# EasyEDA Pro project ProProject_四轴飞行器_2024-06-06.epro

# Schematic Schematic1
Create Date: 2024-06-06; Page Name: P1; Project Name: 四轴飞行器; Schematic Name: Schematic1; Update Date: 2024-06-06; Company: 嘉立创EDA; Page Size: A4; Version: V1.0
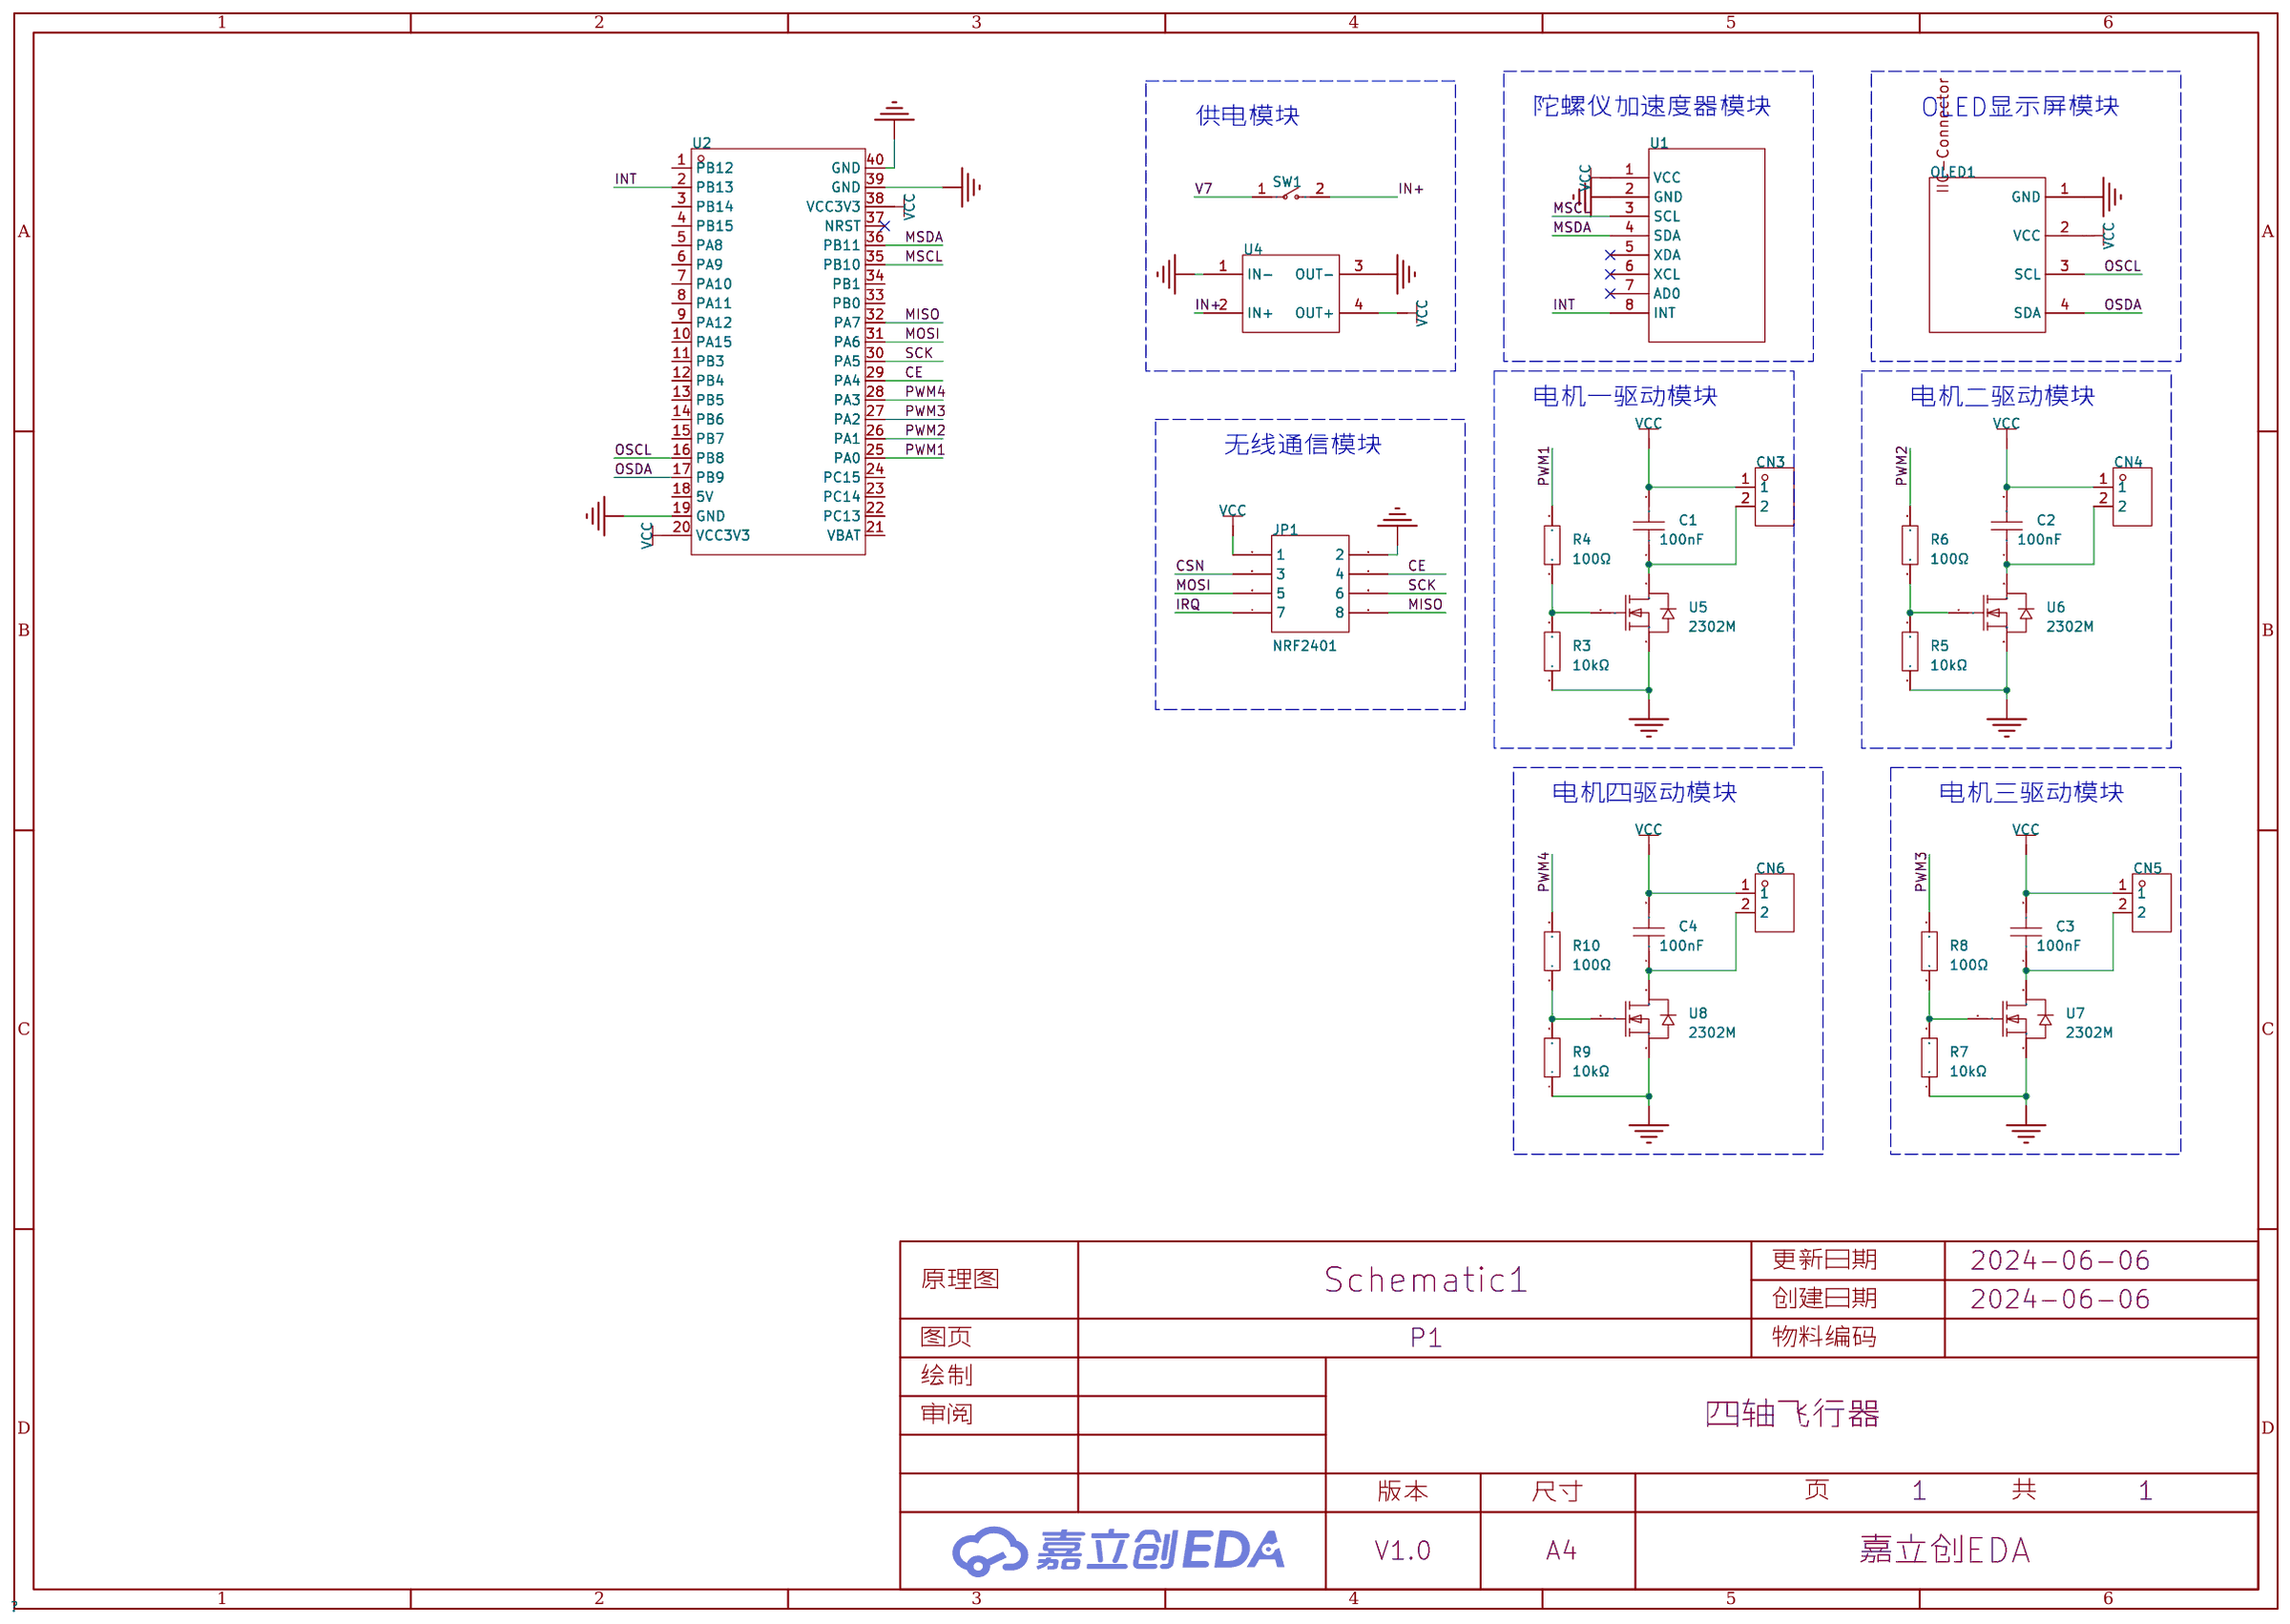
[diagram p0: schematic sheet]

## Parts
C1  100nF  [C0603]
C2  100nF  [C0603]
C3  100nF  [C0603]
C4  100nF  [C0603]
CN3  ZX-XH2.54-2PZZ  [CONN-TH_2P-P2.50_HX25003-2A]
CN4  ZX-XH2.54-2PZZ  [CONN-TH_2P-P2.50_HX25003-2A]
CN5  ZX-XH2.54-2PZZ  [CONN-TH_2P-P2.50_HX25003-2A]
CN6  ZX-XH2.54-2PZZ  [CONN-TH_2P-P2.50_HX25003-2A]
JP1  NRF2401  [IDE2X4]
OLED1  0.96OLED_4P_MODULE_JX  [0.96OLED_4P]
R3  10kΩ  [R0805]
R4  100Ω  [R0805]
R5  10kΩ  [R0805]
R6  100Ω  [R0805]
R7  10kΩ  [R0805]
R8  100Ω  [R0805]
R9  10kΩ  [R0805]
R10  100Ω  [R0805]
SW1  KCD11-2P-R  [SW-TH_2P-L15.0-W10.5-P5.00_KCD11-2P-R]
U1  -  [Module-MPU6050]
U2  STM32F103C8T6-Card  [CONN-TH_L53.3-W22.9_STM32F103C8T6-CARD]
U4  -  [MP1548EN可调电源模块]
U5  2302M  [SOT-23-3_L2.9-W1.3-P0.95-LS2.4-BR]
U6  2302M  [SOT-23-3_L2.9-W1.3-P0.95-LS2.4-BR]
U7  2302M  [SOT-23-3_L2.9-W1.3-P0.95-LS2.4-BR]
U8  2302M  [SOT-23-3_L2.9-W1.3-P0.95-LS2.4-BR]

## Library data of the parts
C1-C4 = CC0603KRX7R9BB104: 容值:100nF;精度:±10%;额定电压:50V;材质(温度系数):X7R;; LCSC Part Name: 100nF ±10% 50V; Supplier Part: C14663; Manufacturer: YAGEO(国巨); Supplier Footprint: 0603; Datasheet: https://atta.szlcsc.com/upload/public/pdf/source/20180910/C282072_33301C7F631E79921B82A8DAC6BCC5B3.pdf; Supplier: LCSC; Tolerance: ±10%; Voltage Rated: 50V; Temperature Coefficient: X7R
CN3-CN6 = ZX-XH2.54-2PZZ: 插针结构:1x2P;间距:2.54mm;安装方式:直插;参考系列:XH;总PIN数:2P;排数:1;每排PIN数:2;行距:-;额定电流:3A;触头材质:黄铜;触头镀层:锡;工作温度范围:-25℃~+85℃;; Supplier Part: C7429632; Manufacturer: Megastar(兆星); Supplier Footprint: 插件,P=2.54mm; JLCPCB Part Class: 扩展库; Datasheet: https://atta.szlcsc.com/upload/public/pdf/source/20230619/19BA6947230AA44A04D3EDD65E618FD0.pdf; Supplier: LCSC; Pins Structure: 1x2P; Pitch: 2.54mm; Mounting Style: 直插; Reference Series: XH; Number of Pins: 2P; Number of Rows: 1; Number of PINs Per Row: 2; Current Rating (Max): 3A; Contact Material: 黄铜; Contact Plating: 锡; Operating Temperature Range: -25℃~+85℃
JP1 = NRF2401
OLED1 = 0.96OLED_4P_MODULE_JX: Supplier Part: C9900004566; Supplier Footprint: 插件; JLCPCB Part Class: 扩展库; Supplier: LCSC
R3 R5 R7 R9 = 0805W8F1002T5E_C17414: 电阻类型:厚膜电阻;阻值:10kΩ;精度:±1%;功率:125mW;最大工作电压:150V;温度系数:±100ppm/℃;; LCSC Part Name: 10kΩ ±1% 125mW 厚膜电阻; Supplier Part: C17414; Manufacturer: UNI-ROYAL(厚声); Manufacturer Part: 0805W8F1002T5E; Supplier Footprint: 0805; Datasheet: https://atta.szlcsc.com/upload/public/pdf/source/20200306/C422600_1E6D84923E4A46A82E41ADD87F860B5C.pdf; Supplier: LCSC; Type: 厚膜电阻; Tolerance: ±1%; Power(Watts): 125mW; Overload Voltage (Max): 150V; Temperature Coefficient: ±100ppm/℃; Operating Temperature Range: -55℃~+155℃
R4 R6 R8 R10 = 0805W8F1000T5E: 电阻类型:厚膜电阻;阻值:100Ω;精度:±1%;功率:125mW;最大工作电压:150V;温度系数:±100ppm/℃;; LCSC Part Name: 100Ω ±1% 125mW 厚膜电阻; Supplier Part: C17408; Manufacturer: UNI-ROYAL(厚声); Supplier Footprint: 0805; Datasheet: https://atta.szlcsc.com/upload/public/pdf/source/20200306/C422600_1E6D84923E4A46A82E41ADD87F860B5C.pdf; Supplier: LCSC; Type: 厚膜电阻; Tolerance: ±1%; Power(Watts): 125mW; Overload Voltage (Max): 150V; Temperature Coefficient: ±100ppm/℃; Operating Temperature Range: -55℃~+155℃
SW1 = KCD11-2P-R: 带灯:无;引脚样式:焊片;额定电流:3A;额定电压(AC):250V;额定电压(DC):-;电路结构:单刀单掷;机械寿命:1万次;; LCSC Part Name: 10.5*15mm 两脚两档跷板开关 红钮; Supplier Part: C5884414; Manufacturer: SHOU HAN(首韩); Supplier Footprint: 插件; JLCPCB Part Class: 扩展库; Datasheet: https://atta.szlcsc.com/upload/public/pdf/source/20230506/CD06DFDE35C8048D34175BFF4AF6A2C2.pdf; Supplier: LCSC; Switch Length: 15mm; Switch Width: 10.5mm; Switch Height: 17.2mm; Actuator Type: 凹面弯曲; With Lamp: 无; Pin Style: 焊片; Actuator Color: 红色; Contact Current: 3A; Voltage Rating (AC): 250V; Circuit: 单刀单掷; Mechanical Life: 1万次; Operating Temperature: 0℃~+125℃; Actuator Identifier: - O
U1 = MPU6050模块
U2 = STM32F103C8T6-Card: Supplier Part: C9900077949; Supplier Footprint: 插件; Supplier: LCSC
U4 = MP1584EN可调电源降压模块: 输入4.5-28V；输出0.8-20V，Max3A；尺寸22*17*4mm; Manufacturer: 淘宝zave旗舰店
U5-U8 = 2302M: Supplier Part: C19190096; Manufacturer: FM(富满); Supplier Footprint: SOT-23; JLCPCB Part Class: 扩展库; Datasheet: https://atta.szlcsc.com/upload/public/pdf/source/20231110/5623DCBBA52FDE627159EDA877003895.pdf; Supplier: LCSC

## Nets
GND: JP1.2 OLED1.1(GND) R3.1 R5.1 R7.1 R9.1 U1.2(GND) U2.19(GND) U2.39(GND) U2.40(GND) U4.1(IN-) U4.3(OUT-) U5.2(S) U6.2(S) U7.2(S) U8.2(S)
V7: SW1.1
VCC: C1.2 C2.2 C3.2 C4.2 CN3.1 CN4.1 CN5.1 CN6.1 JP1.1 OLED1.2(VCC) U1.1(VCC) U2.20(VCC3V3) U2.38(VCC3V3) U4.4(OUT+)
CE: JP1.4 U2.29(PA4)
CSN: JP1.3
IN+: SW1.2 U4.2(IN+)
INT: U1.8(INT) U2.2(PB13)
IRQ: JP1.7
MISO: JP1.8 U2.32(PA7)
MOSI: JP1.5 U2.31(PA6)
MSCL: U1.3(SCL) U2.35(PB10)
MSDA: U1.4(SDA) U2.36(PB11)
OSCL: OLED1.3(SCL) U2.16(PB8)
OSDA: OLED1.4(SDA) U2.17(PB9)
PWM1: R4.2 U2.25(PA0)
PWM2: R6.2 U2.26(PA1)
PWM3: R8.2 U2.27(PA2)
PWM4: R10.2 U2.28(PA3)
SCK: JP1.6 U2.30(PA5)
$1N1265: R3.2 R4.1 U5.1(G)
$1N1421: C1.1 CN3.2 U5.3(D)
$1N1658: R5.2 R6.1 U6.1(G)
$1N1665: C2.1 CN4.2 U6.3(D)
$1N1881: R7.2 R8.1 U7.1(G)
$1N1888: C3.1 CN5.2 U7.3(D)
$1N2104: R9.2 R10.1 U8.1(G)
$1N2111: C4.1 CN6.2 U8.3(D)

Not connected (* = marked no-connect by the designer): U1 5(XDA)* 6(XCL)* 7(AD0)*; U2 1(PB12) 3(PB14) 4(PB15) 5(PA8) 6(PA9) 7(PA10) 8(PA11) 9(PA12) 10(PA15) 11(PB3) 12(PB4) 13(PB5) 14(PB6) 15(PB7) 18(5V) 21(VBAT) 22(PC13) 23(PC14) 24(PC15) 33(PB0) 34(PB1) 37(NRST)*

## Notes on the sheet
- 供电模块
- 陀螺仪加速度器模块
- OLED显示屏模块
- 电机一驱动模块
- 电机二驱动模块
- 无线通信模块
- 电机四驱动模块
- 电机三驱动模块

# Board PCB1
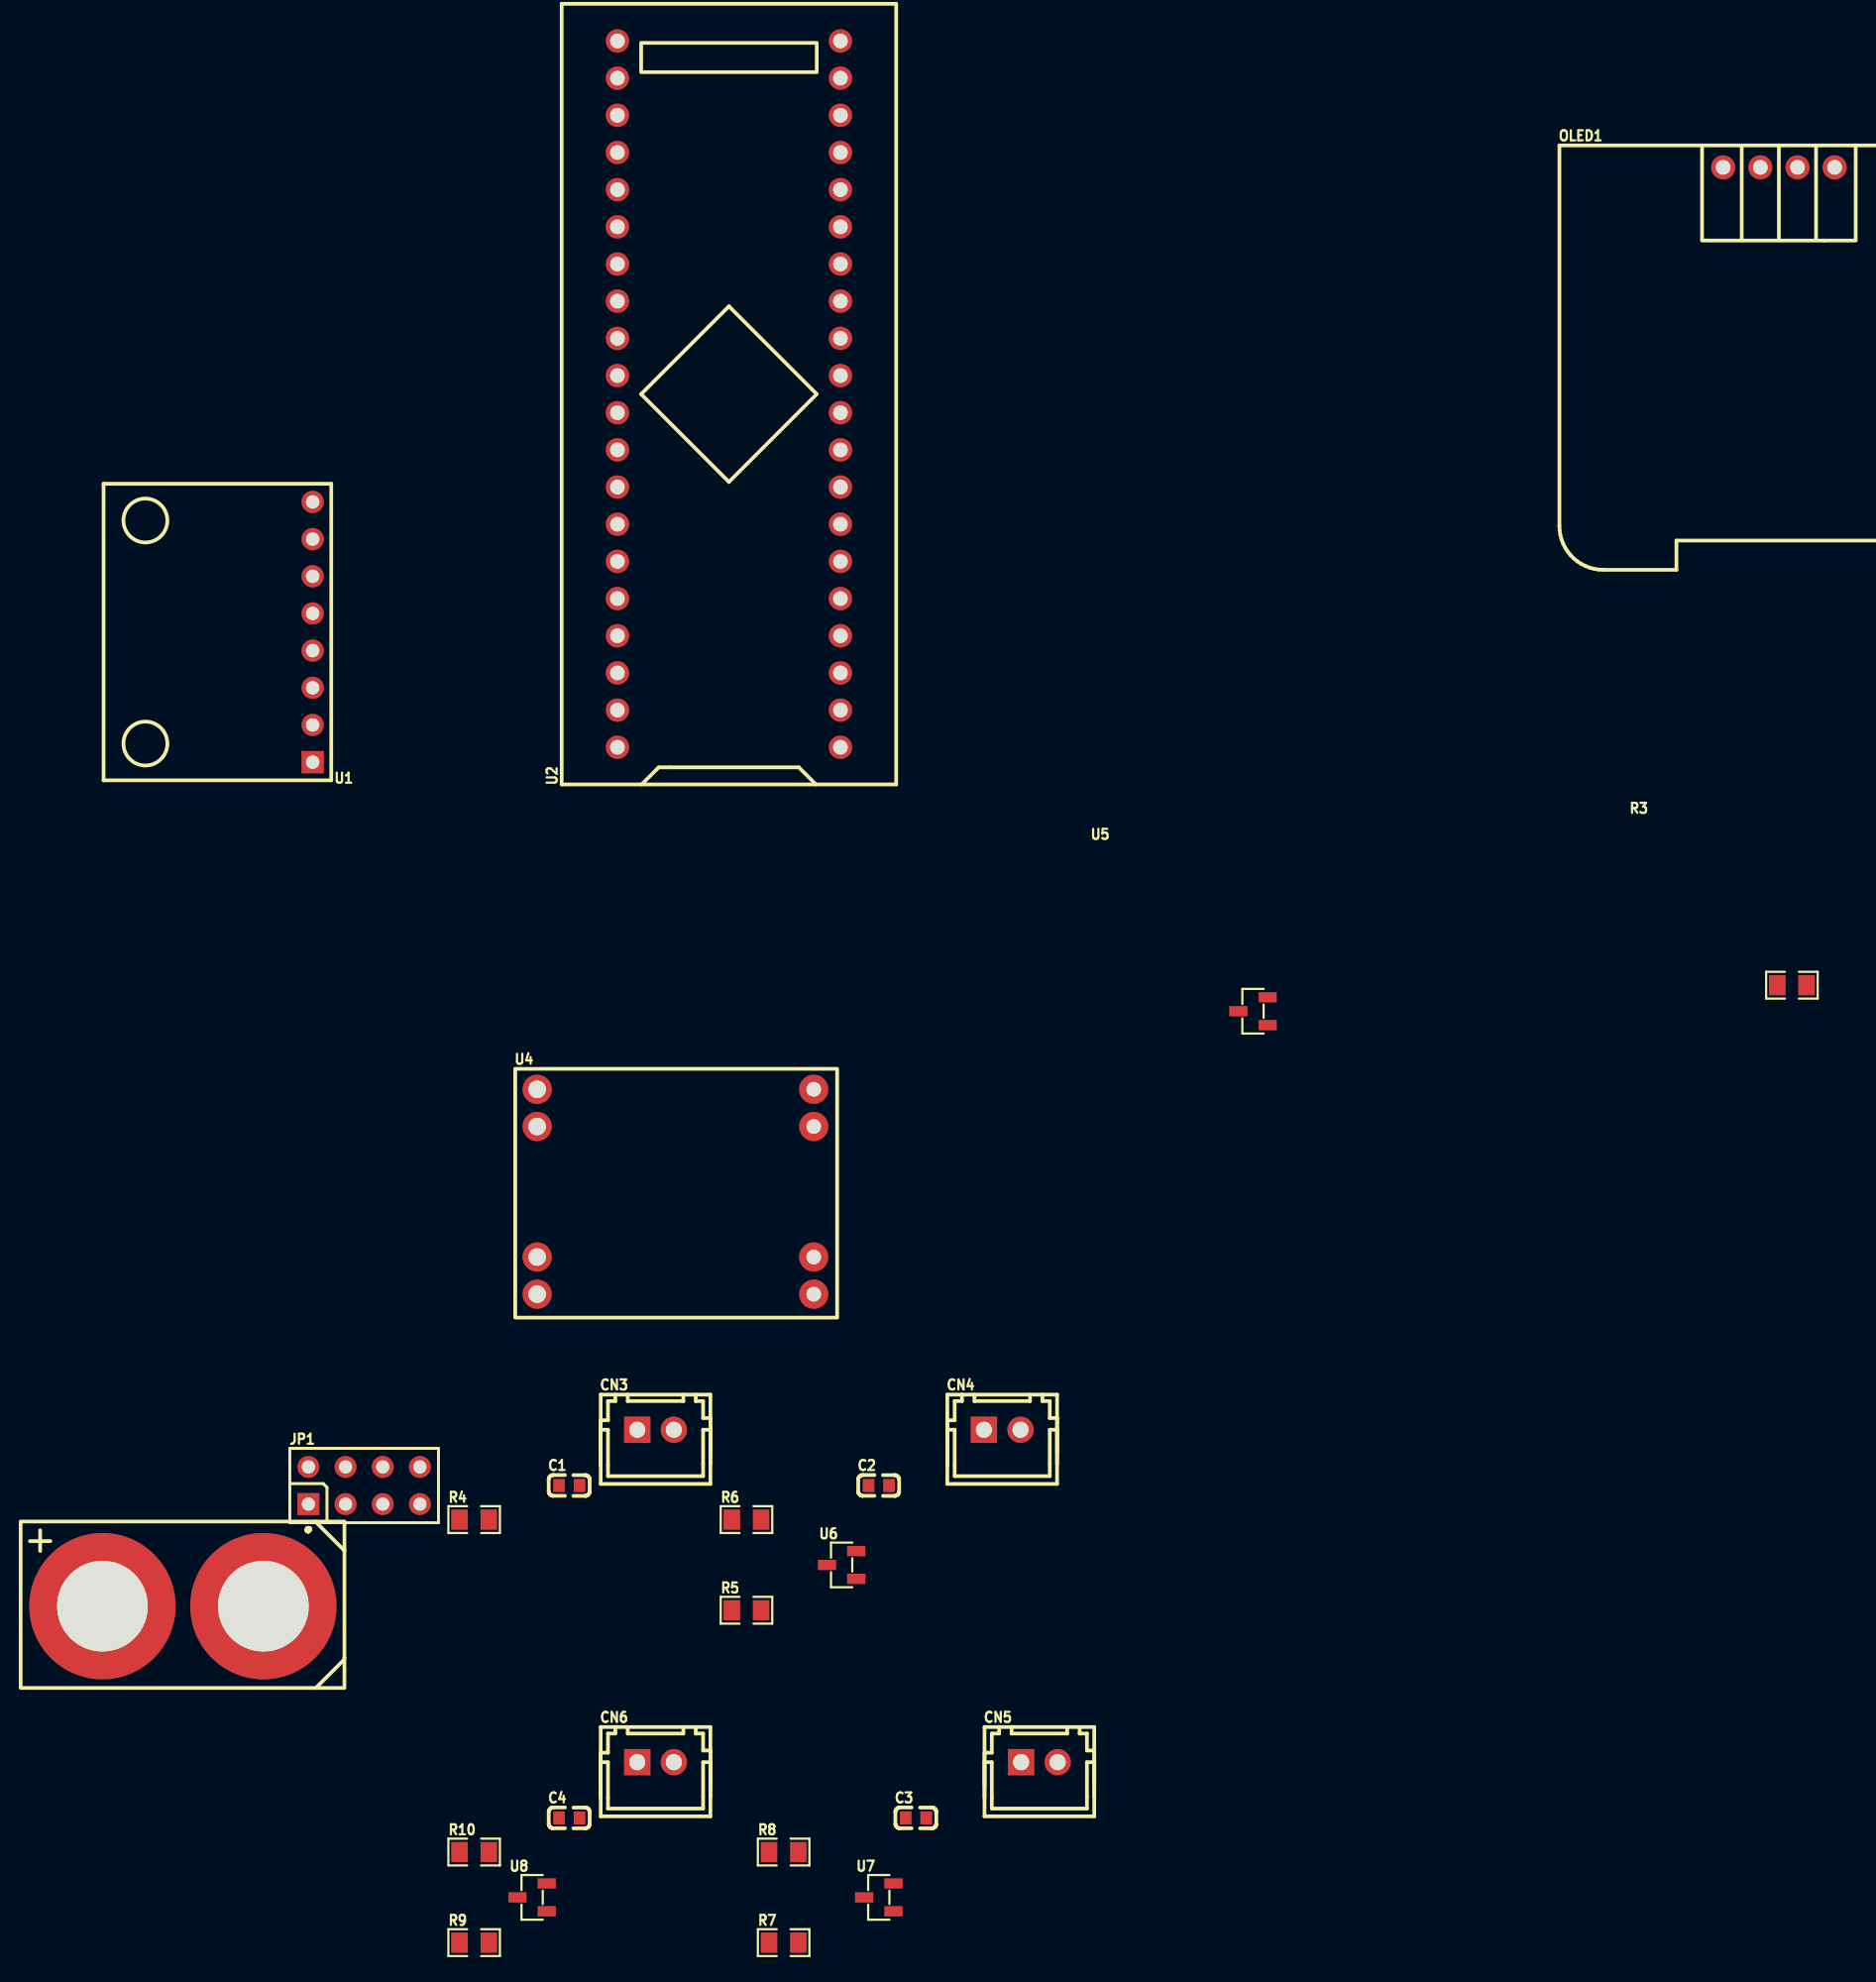
[diagram p1: board, top side]
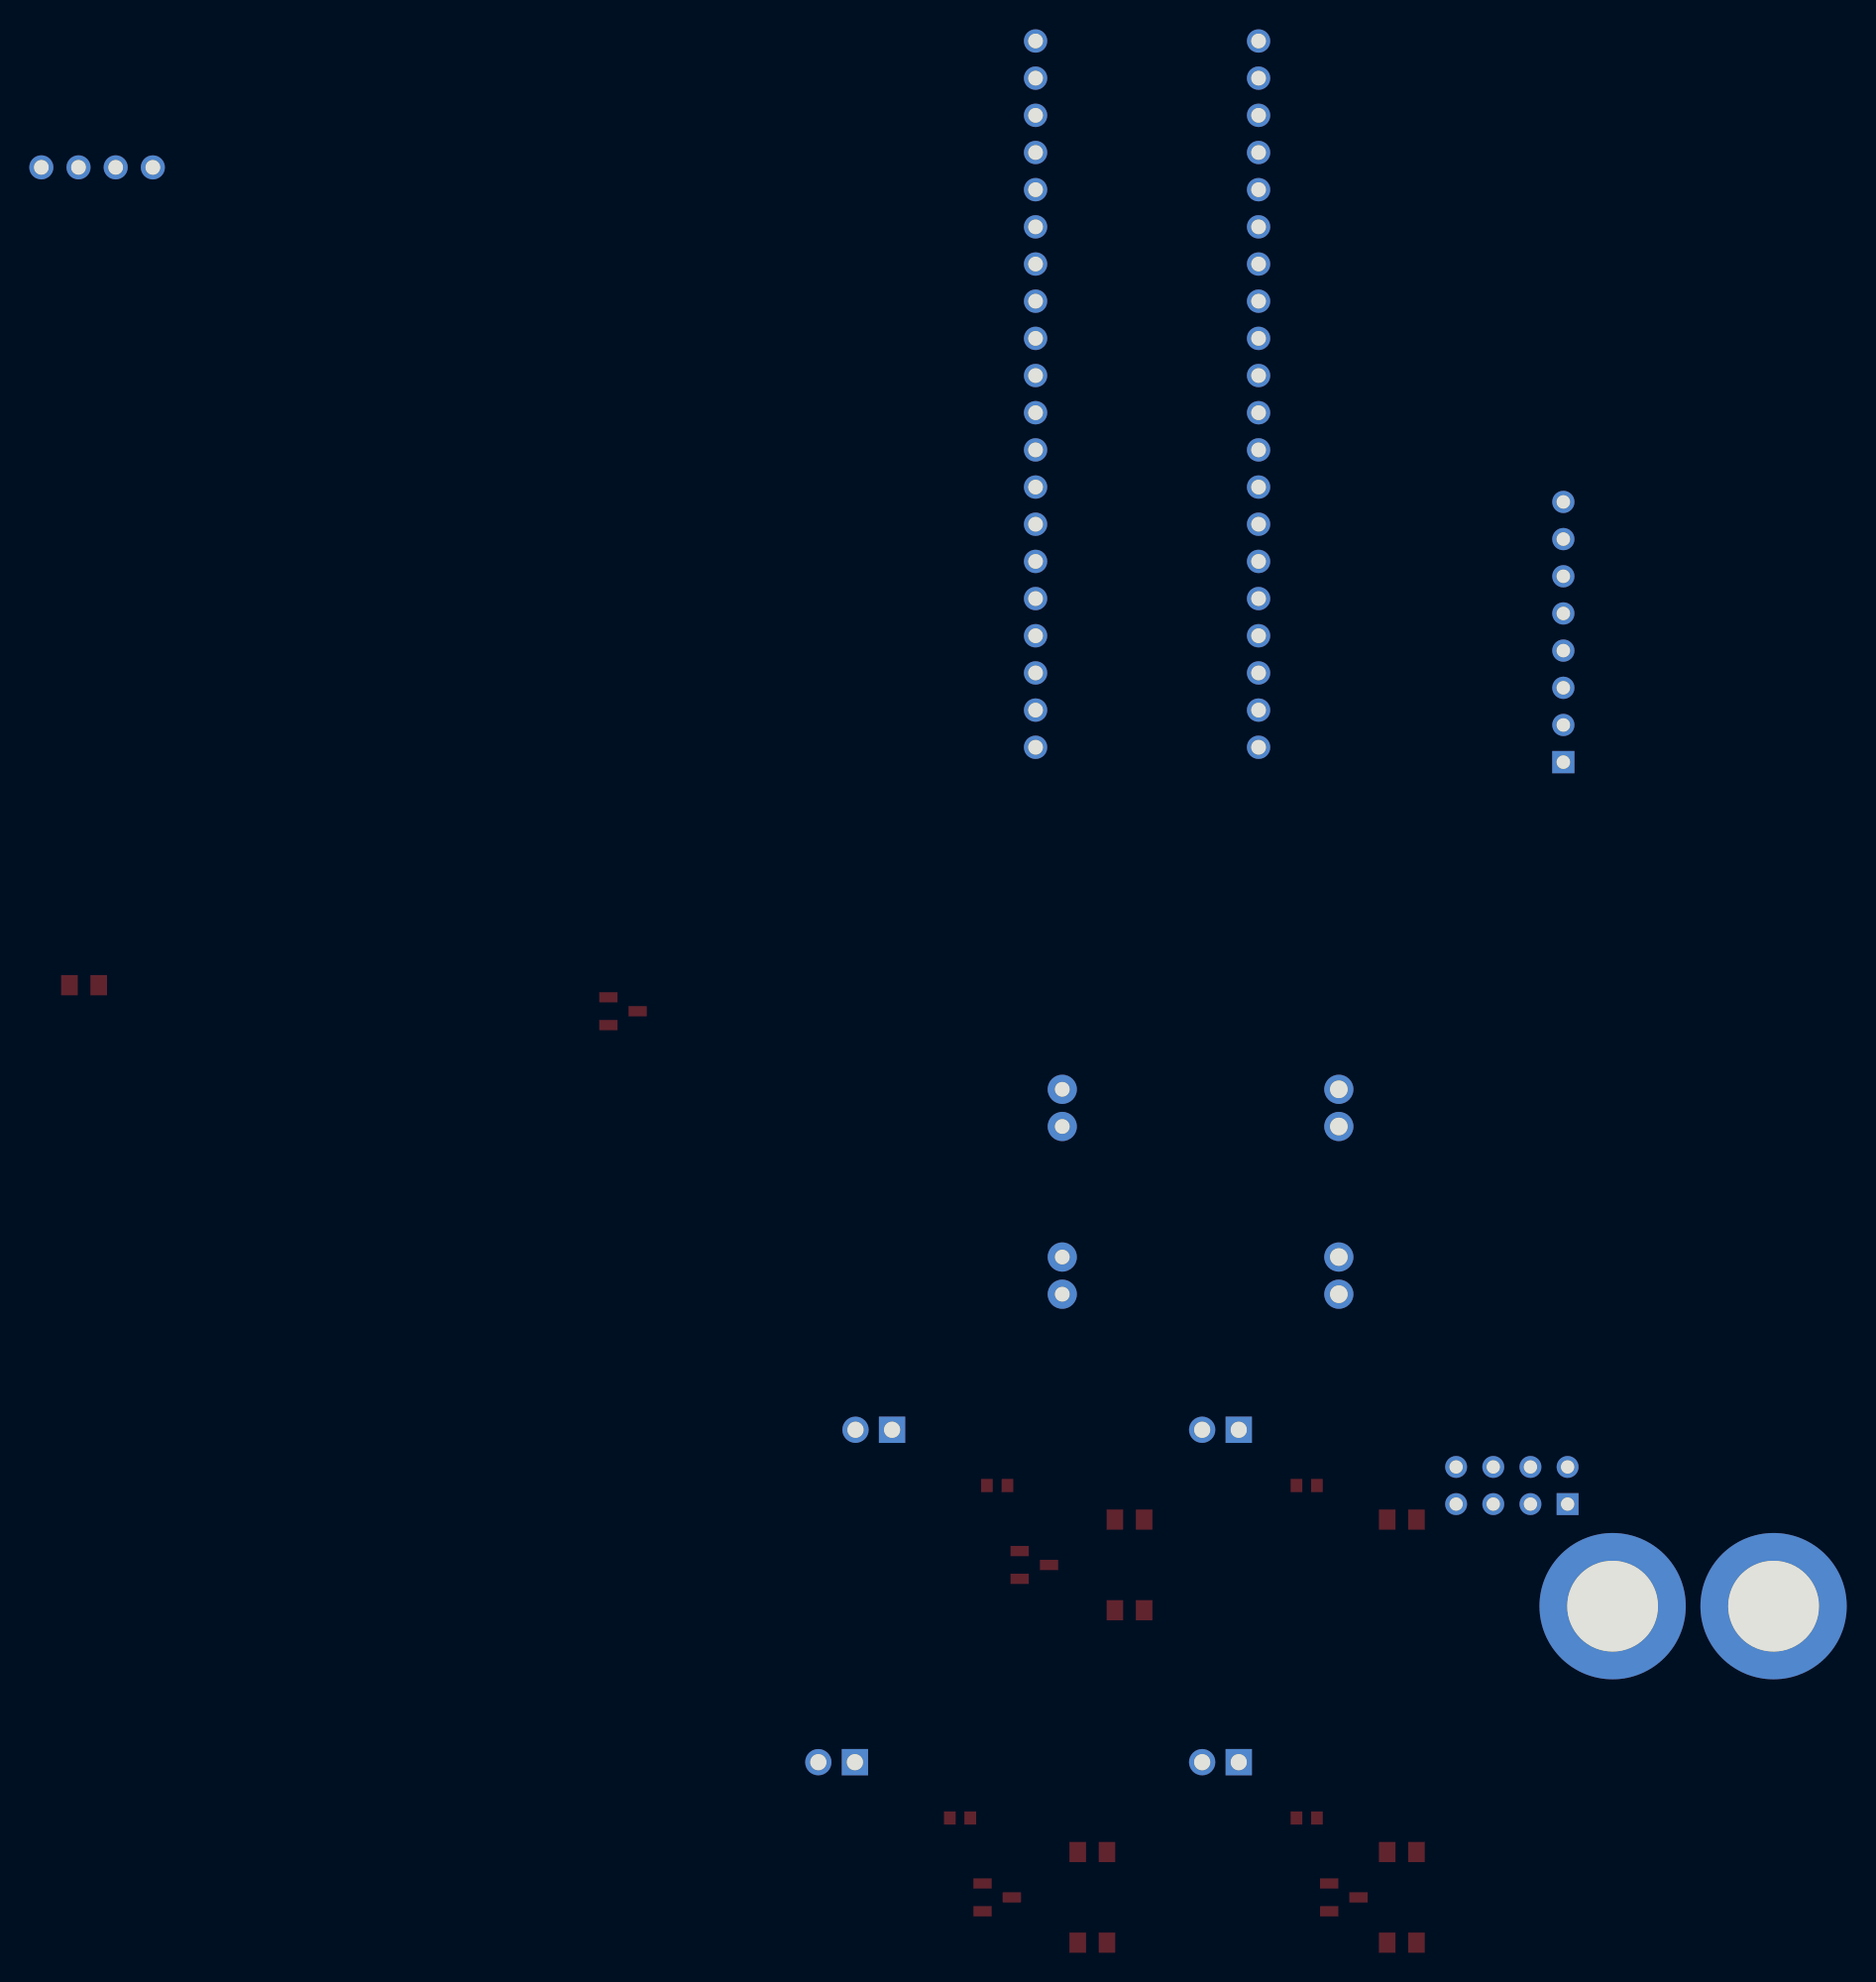
[diagram p2: board, bottom side, seen from below]

No outline. copper layers: Top Layer, Bottom Layer. Coordinates in mm from the lowest, leftmost part position.
Stack: Top Layer 0.035mm / Dielectric1 1.51mm FR4 er 4.5 / Bottom Layer 0.035mm

## Design rules (mm)
template: JLCPCB Capability(Two Layers Board)
spacing copperThickness1oz (default): track to track 0.102, other pairs 0.152 to 0.3
spacing copperThickness2oz: track to track 0.203, other pairs 0.152 to 0.3
track width copperThickness1oz (default): min 0.127, default 0.254, max 2.54
track width copperThickness2oz: min 0.203, default 0.254, max 2.54
differential pair differentialPair (default): width min 0.127, default 0.254, max 2.54; gap min 0.152, default 0.152
via viaSize (default): diameter min 0.5, default 0.61, max 10; hole min 0.3, default 0.305, max 6.3

## Placement (name value [footprint] x y rotation side)
C1  100nF  [C0603]  25.43 31.24 0 top
C2  100nF  [C0603]  46.58 31.24 0 top
C3  100nF  [C0603]  49.12 8.52 0 top
C4  100nF  [C0603]  25.43 8.52 0 top
CN3  ZX-XH2.54-2PZZ  [CONN-TH_2P-P2.50_HX25003-2A]  31.32 35.05 0 top
CN4  ZX-XH2.54-2PZZ  [CONN-TH_2P-P2.50_HX25003-2A]  55.01 35.05 0 top
CN5  ZX-XH2.54-2PZZ  [CONN-TH_2P-P2.50_HX25003-2A]  57.55 12.33 0 top
CN6  ZX-XH2.54-2PZZ  [CONN-TH_2P-P2.50_HX25003-2A]  31.32 12.33 0 top
JP1  NRF2401  [IDE2X4]  7.6 29.97 0 top
OLED1  0.96OLED_4P_MODULE_JX  [0.96OLED_4P]  108.09 121.3 0 top
R3  10kΩ  [R0805]  108.98 65.42 0 top
R4  100Ω  [R0805]  18.93 28.91 0 top
R5  10kΩ  [R0805]  37.54 22.71 0 top
R6  100Ω  [R0805]  37.54 28.91 0 top
R7  10kΩ  [R0805]  40.08 0 0 top
R8  100Ω  [R0805]  40.08 6.19 0 top
R9  10kΩ  [R0805]  18.93 0 0 top
R10  100Ω  [R0805]  18.93 6.19 0 top
U1  -  [Module-MPU6050]  2.81 88.28 180 top
U2  STM32F103C8T6-Card  [CONN-TH_L53.3-W22.9_STM32F103C8T6-CARD]  36.34 105.81 90 top
U4  -  [MP1548EN可调电源模块]  21.73 59.71 0 top
U5  2302M  [SOT-23-3_L2.9-W1.3-P0.95-LS2.4-BR]  72.15 63.64 0 top
U6  2302M  [SOT-23-3_L2.9-W1.3-P0.95-LS2.4-BR]  44.04 25.81 0 top
U7  2302M  [SOT-23-3_L2.9-W1.3-P0.95-LS2.4-BR]  46.58 3.1 0 top
U8  2302M  [SOT-23-3_L2.9-W1.3-P0.95-LS2.4-BR]  22.89 3.1 0 top
U9  -  [XT90]  0 18.29 0 top

## Footprints (pads in the part's own frame, mm; a bottom-side part is the same pattern mirrored in y, then rotated)
0.96OLED_4P
  round 1.65 hole 1: 1(-3.81,-0.002) 2(-1.27,0.002) 3(1.27,0.002) 4(3.81,0.002)
C0603
  rect 0.8x0.9 smd: 1(-0.7,0) 2(0.7,0)
CONN-TH_2P-P2.50_HX25003-2A
  rect 1.8x1.8 hole 1.1: 1(-1.25,0)
  round 1.8 hole 1.1: 2(1.25,0)
CONN-TH_L53.3-W22.9_STM32F103C8T6-CARD
  round 1.6 hole 1: 1(-24.13,-7.62) 2(-21.59,-7.62) 3(-19.05,-7.62) 4(-16.51,-7.62) 5(-13.97,-7.62) 6(-11.43,-7.62) 7(-8.89,-7.62) 8(-6.35,-7.62) 9(-3.81,-7.62) 10(-1.27,-7.62) 11(1.27,-7.62) 12(3.81,-7.62) 13(6.35,-7.62) 14(8.89,-7.62) 15(11.43,-7.62) 16(13.97,-7.62) 17(16.51,-7.62) 18(19.05,-7.62) 19(21.59,-7.62) 20(24.13,-7.62) 21(24.13,7.62) 22(21.59,7.62) 23(19.05,7.62) 24(16.51,7.62) 25(13.97,7.62) 26(11.43,7.62) 27(8.89,7.62) 28(6.35,7.62) 29(3.81,7.62) 30(1.27,7.62) 31(-1.27,7.62) 32(-3.81,7.62) 33(-6.35,7.62) 34(-8.89,7.62) 35(-11.43,7.62) 36(-13.97,7.62) 37(-16.51,7.62) 38(-19.05,7.62) 39(-21.59,7.62) 40(-24.13,7.62)
IDE2X4
  rect 1.5x1.5 hole 0.9: 1(0,0)
  round 1.5 hole 0.9: 2(0,2.54) 3(2.54,0) 4(2.54,2.54) 5(5.08,0) 6(5.08,2.54) 7(7.62,0) 8(7.62,2.54)
Module-MPU6050
  rect 1.524x1.524 hole 0.914: 1(-5.08,7.62)
  round 1.524 hole 0.914: 2(-5.08,5.08) 3(-5.08,2.54) 4(-5.08,0) 5(-5.08,-2.54) 6(-5.08,-5.08) 7(-5.08,-7.62) 8(-5.08,-10.16)
MP1548EN可调电源模块
  round 2 hole 1.2: 1(1.5,-1.4) 1(1.5,-3.94) 2(1.5,-12.86) 2(1.5,-15.4)
  round 2 hole 1: 3(20.4,-1.4) 3(20.4,-3.94) 4(20.4,-12.86) 4(20.4,-15.4)
R0805
  rect 1.133x1.377 smd: 1(-1,0) 2(1,0)
SOT-23-3_L2.9-W1.3-P0.95-LS2.4-BR
  rect 1.25x0.7 smd: 1(1,-0.95) 2(1,0.95) 3(-1,0)
XT90
  round 10 hole 6.2: 1(-6.477,4.699) 2(4.523,4.699)

## Nets
As in the schematic, except:
GND: JP1.2 OLED1.1 R3.1 R5.1 R7.1 R9.1 U1.2 U2.19 U2.39 U2.40 U5.2 U6.2 U7.2 U8.2
VCC: C1.2 C2.2 C3.2 C4.2 CN3.1 CN4.1 CN5.1 CN6.1 JP1.1 OLED1.2 U1.1 U2.20 U2.38

Pads without a net: U1 5 6 7; U2 1 3 4 5 6 7 8 9 10 11 12 13 14 15 18 21 22 23 24 33 34 37; U4 1 2 3 4; U9 1 2
